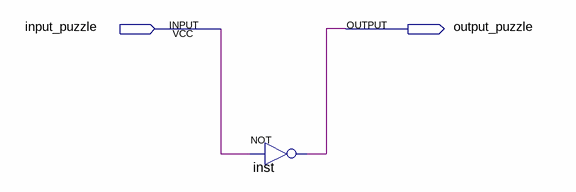
[diagram p0: schematic sheet]
// Quartus schematic user_puzzle.bdf as structural Verilog: 1 symbols, 2 pins
module user_puzzle (
  input  input_puzzle,
  output output_puzzle
);

  not inst (output_puzzle, input_puzzle);
endmodule
